# EAGLE design HallShield (EAGLE 6.2)

## Sheet 1 of 2
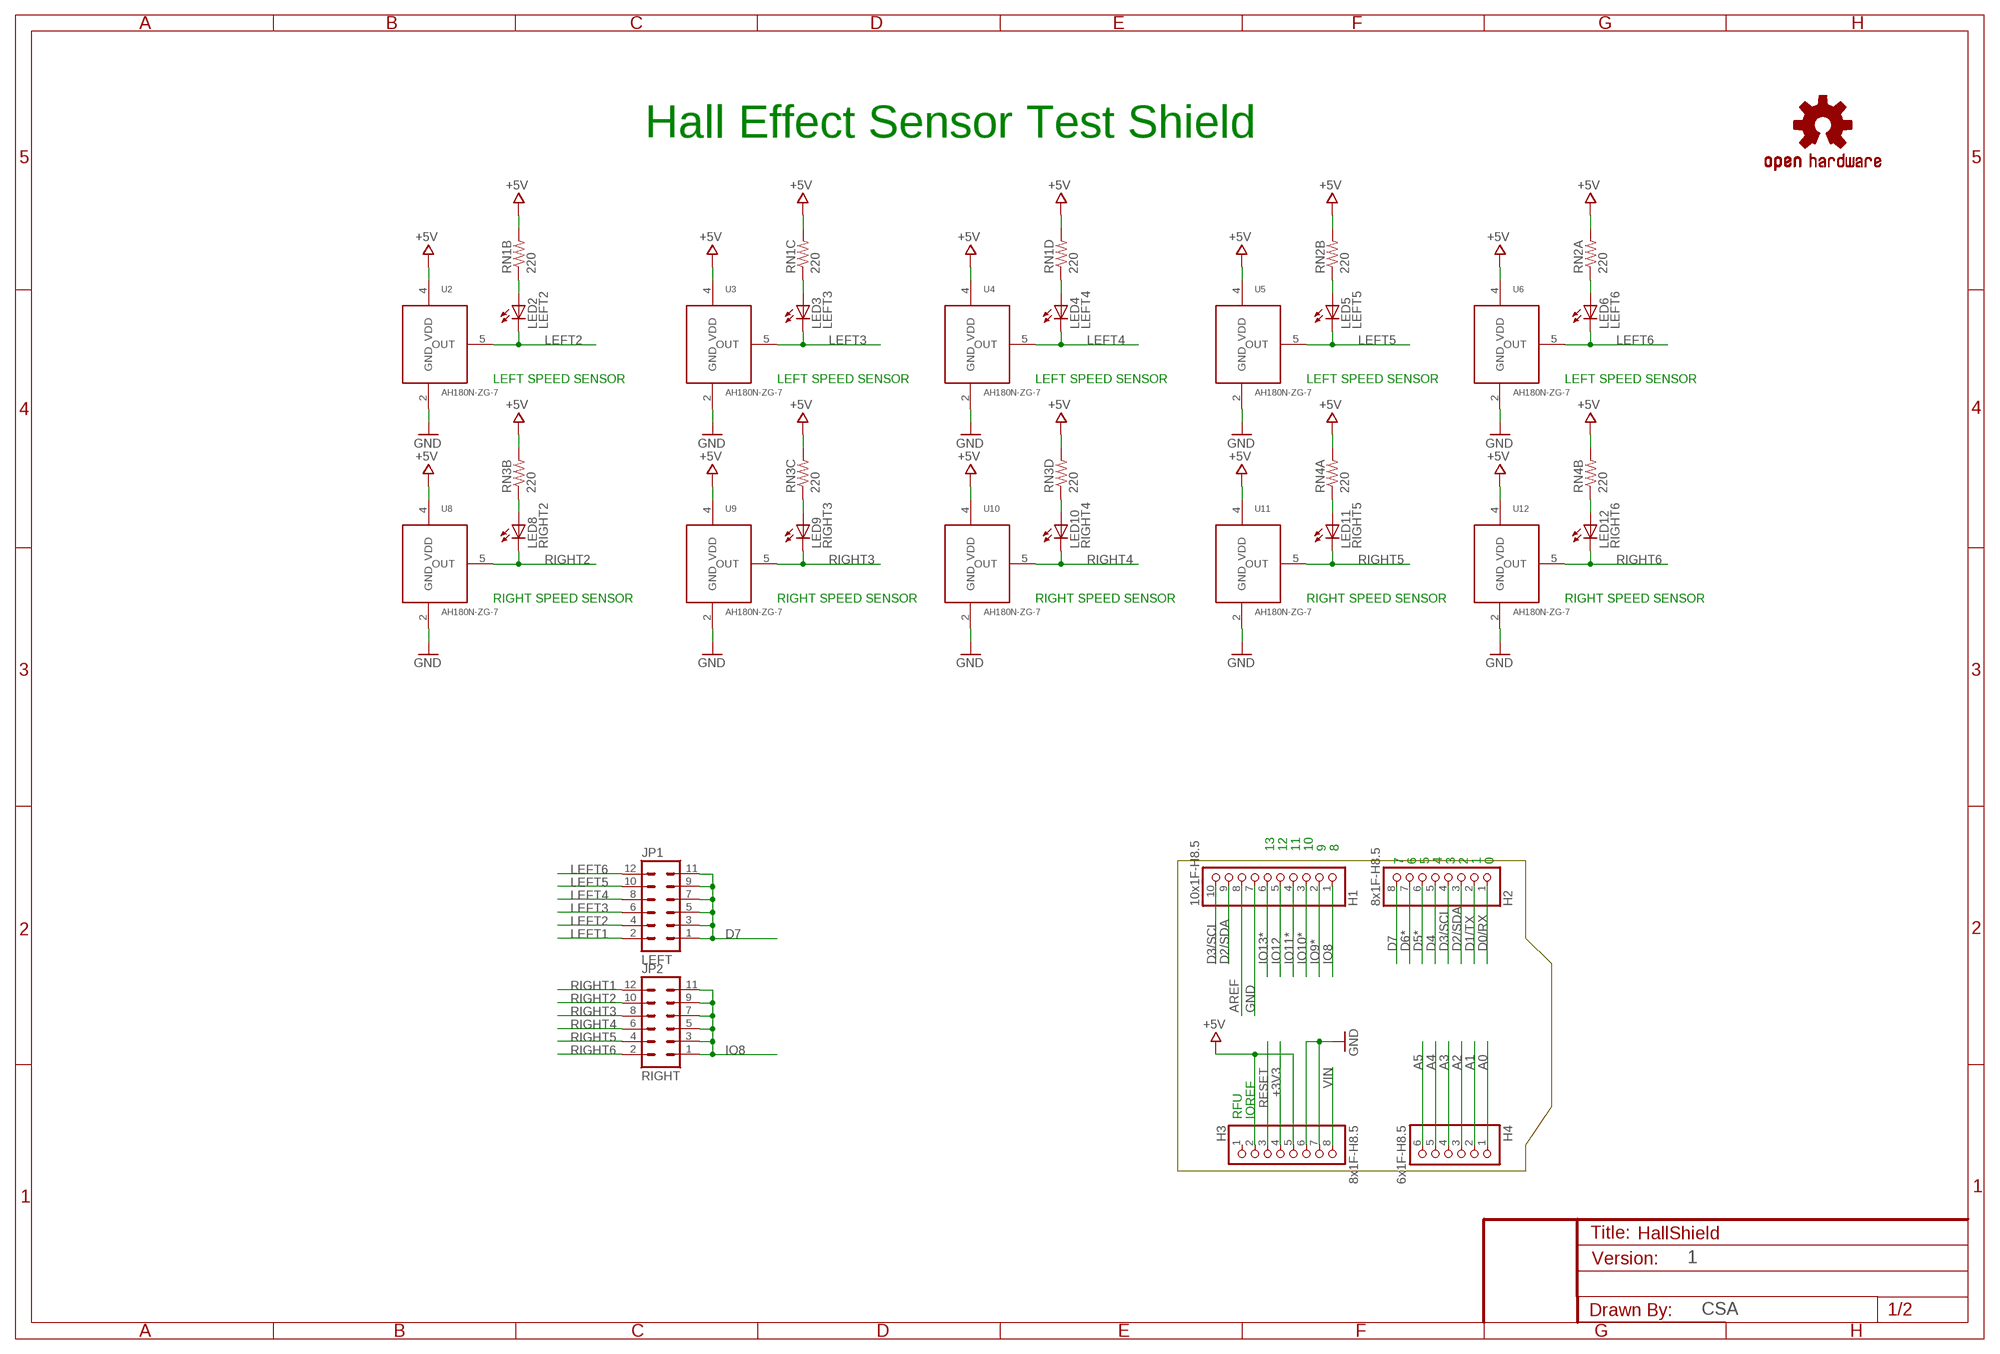
[diagram p0: schematic, sheet 1]

### Parts
H1  10x1F-H8.5  PINHD-1X10  [1X10]
H2  8x1F-H8.5  PINHD-1X8  [1X08]
H3  8x1F-H8.5  PINHD-1X8  [1X08]
H4  6x1F-H8.5  PINHD-1X6  [1X06]
JP1  LEFT  MA06-2  [MA06-2]
JP2  RIGHT  MA06-2  [MA06-2]
LED2  LEFT2  LED0805  [LED0805]
LED3  LEFT3  LED0805  [LED0805]
LED4  LEFT4  LED0805  [LED0805]
LED5  LEFT5  LED0805  [LED0805]
LED6  LEFT6  LED0805  [LED0805]
LED8  RIGHT2  LED0805  [LED0805]
LED9  RIGHT3  LED0805  [LED0805]
LED10  RIGHT4  LED0805  [LED0805]
LED11  RIGHT5  LED0805  [LED0805]
LED12  RIGHT6  LED0805  [LED0805]
RN1  220  RESISTOR-ARRAYCRA06S  [CRA06S]
RN2  220  RESISTOR-ARRAYCRA06S  [CRA06S]
RN3  220  RESISTOR-ARRAYCRA06S  [CRA06S]
RN4  220  RESISTOR-ARRAYCRA06S  [CRA06S]
U2  AH180N-ZG-7  [SOT553]
U3  AH180N-ZG-7  [SOT553]
U4  AH180N-ZG-7  [SOT553]
U5  AH180N-ZG-7  [SOT553]
U6  AH180N-ZG-7  [SOT553]
U8  AH180N-ZG-7  [SOT553]
U9  AH180N-ZG-7  [SOT553]
U10  AH180N-ZG-7  [SOT553]
U11  AH180N-ZG-7  [SOT553]
U12  AH180N-ZG-7  [SOT553]
U$5  OSHW-LOGOL  [OSHW-LOGO-L]

### Nets
+3V3: H3.4
+5V [power]: H3.2 H3.5 RN1.5 RN1.6 RN1.7 RN2.7 RN2.8 RN3.5 RN3.6 RN3.7 RN4.7 RN4.8 U2.4(VDD) U3.4(VDD) U4.4(VDD) U5.4(VDD) U6.4(VDD) U8.4(VDD) U9.4(VDD) U10.4(VDD) U11.4(VDD) U12.4(VDD) ; also sheet 2
A0: H4.1
A1: H4.2
A2: H4.3
A3: H4.4
A4: H4.5
A5: H4.6
AREF [aref]: H1.8
D0/RX: H2.1
D1/TX: H2.2
D2/SDA: H1.9 H2.3
D3/SCL: H1.10 H2.4
D4: H2.5
D5*: H2.6
D6*: H2.7
D7: H2.8 JP1.1 JP1.3 JP1.5 JP1.7 JP1.9 JP1.11
GND [gnd]: H1.7 H3.6 H3.7 U2.2(GND) U3.2(GND) U4.2(GND) U5.2(GND) U6.2(GND) U8.2(GND) U9.2(GND) U10.2(GND) U11.2(GND) U12.2(GND) ; also sheet 2
IO8: H1.1 JP2.1 JP2.3 JP2.5 JP2.7 JP2.9 JP2.11
IO9*: H1.2
IO10*: H1.3
IO11*: H1.4
IO12: H1.5
IO13*: H1.6
LEFT1: JP1.2 ; also sheet 2
LEFT2: JP1.4 LED2.C U2.5(OUT)
LEFT3: JP1.6 LED3.C U3.5(OUT)
LEFT4: JP1.8 LED4.C U4.5(OUT)
LEFT5: JP1.10 LED5.C U5.5(OUT)
LEFT6: JP1.12 LED6.C U6.5(OUT)
N$3: LED2.A RN1.2
N$4: LED3.A RN1.3
N$5: LED4.A RN1.4
N$6: LED5.A RN2.2
N$7: LED6.A RN2.1
N$8: LED8.A RN3.2
N$9: LED9.A RN3.3
N$10: LED10.A RN3.4
N$11: LED11.A RN4.1
N$12: LED12.A RN4.2
RESET: H3.3
RIGHT1: JP2.12 ; also sheet 2
RIGHT2: JP2.10 LED8.C U8.5(OUT)
RIGHT3: JP2.8 LED9.C U9.5(OUT)
RIGHT4: JP2.6 LED10.C U10.5(OUT)
RIGHT5: JP2.4 LED11.C U11.5(OUT)
RIGHT6: JP2.2 LED12.C U12.5(OUT)
VIN [power]: H3.8
Unconnected: H3.1 RN2.3 RN2.4 RN2.5 RN2.6 RN4.3 RN4.4 RN4.5 RN4.6

### Notes on the sheet
- Hall Effect Sensor Test Shield
- LEFT SPEED SENSOR | LEFT SPEED SENSOR | LEFT SPEED SENSOR | LEFT SPEED SENSOR | LEFT SPEED SENSOR
- RIGHT SPEED SENSOR | RIGHT SPEED SENSOR | RIGHT SPEED SENSOR | RIGHT SPEED SENSOR | RIGHT SPEED SENSOR
- 13 | 12 | 11 | 10 | 9 | 8
- 7 | 6 | 5 | 4 | 3 | 2 | 1 | 0
- RFU | IOREF
- 1
- CSA

## Sheet 2 of 2
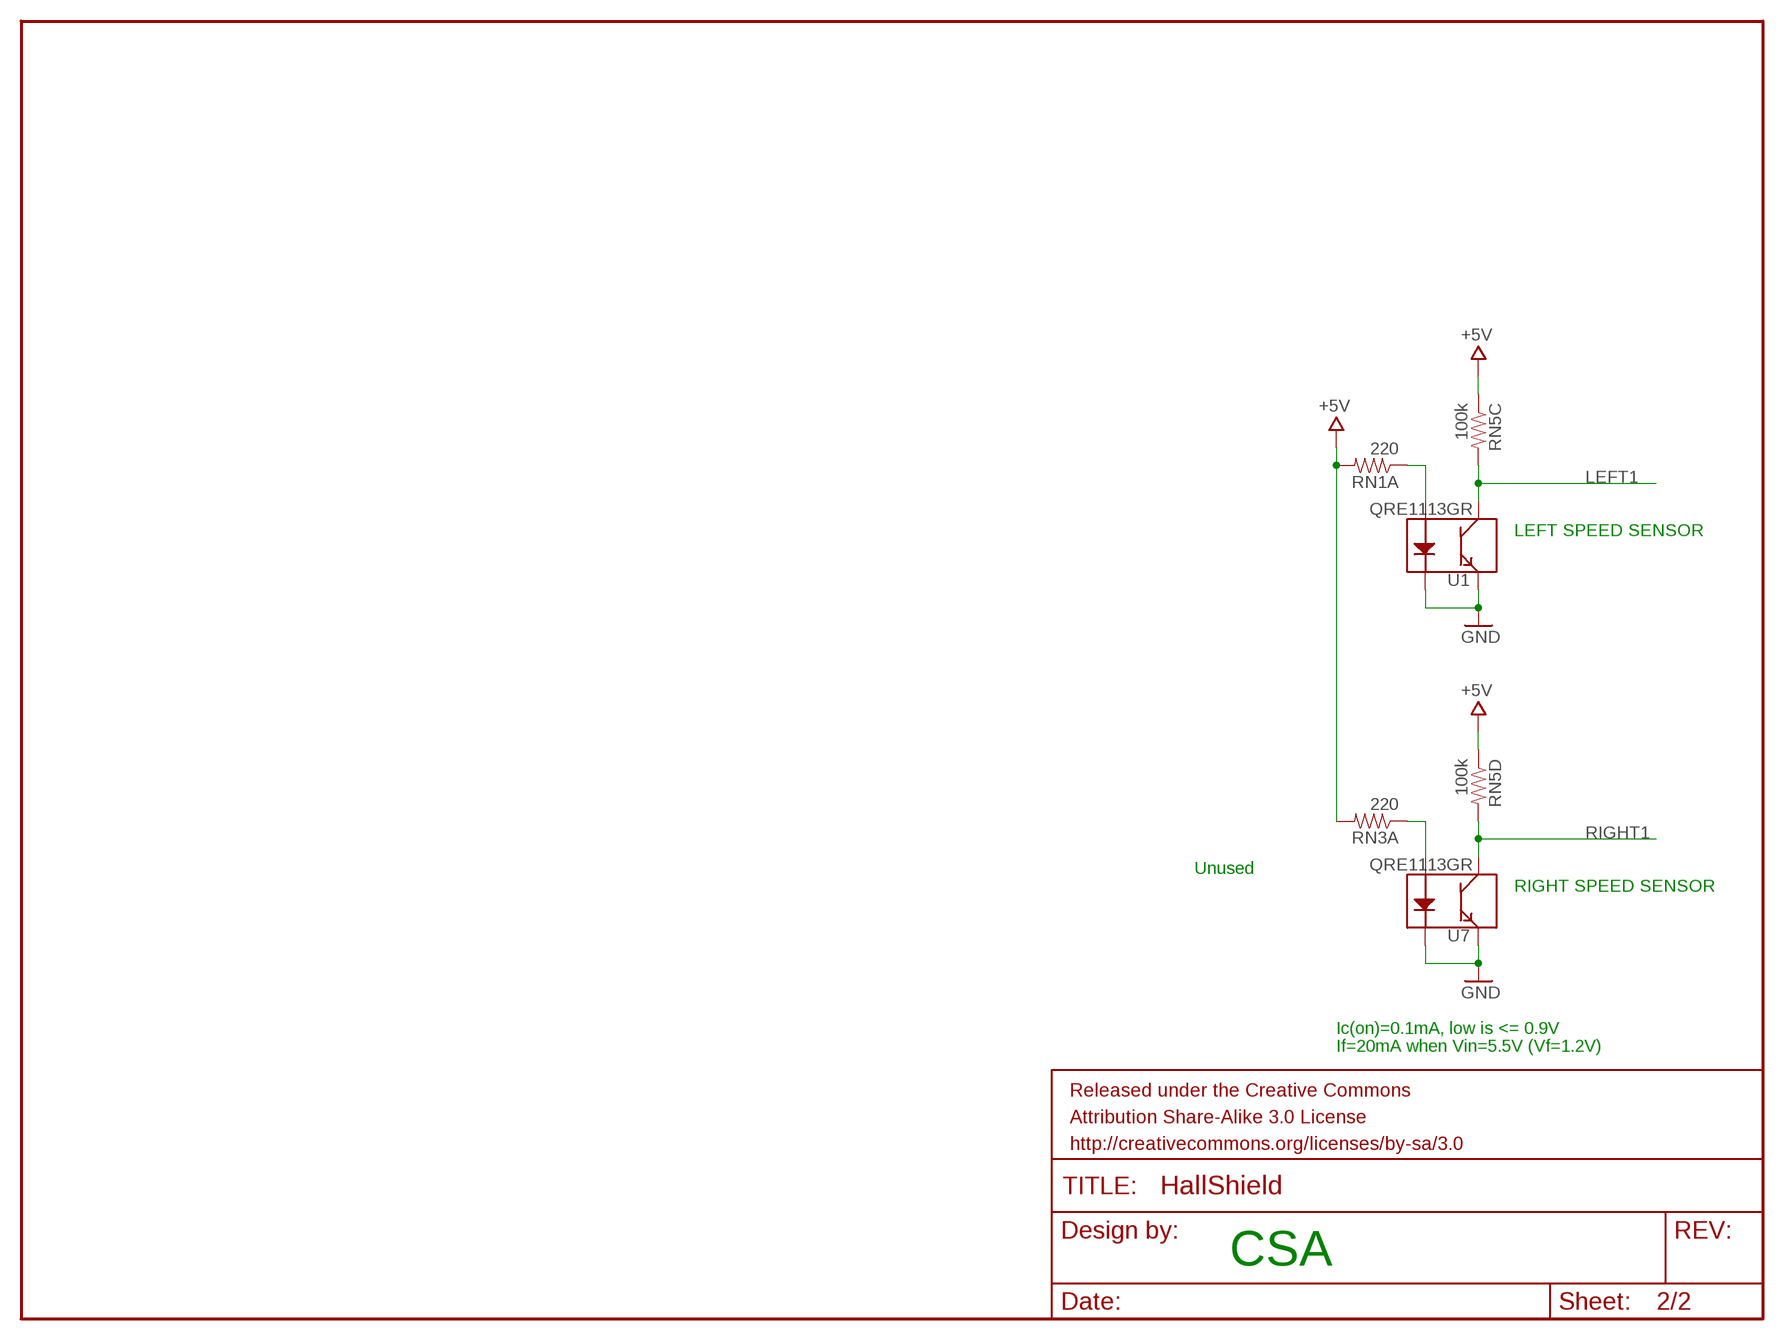
[diagram p1: schematic, sheet 2]

### Parts
RN5  100k  RESISTOR-ARRAYCRA06S  [CRA06S]
U1  QRE1113GR  [QRE1113GR]
U7  QRE1113GR  [QRE1113GR]

### Nets
+5V [power]: RN1.8 RN3.8 RN5.3 RN5.4 ; also sheet 1
GND [gnd]: U1.2(K) U1.4(E) U7.2(K) U7.4(E) ; also sheet 1
LEFT1: RN5.6 U1.3(C) ; also sheet 1
RIGHT1: RN5.5 U7.3(C) ; also sheet 1
U5_ANODE: RN1.1 U1.1(A)
U6_ANODE: RN3.1 U7.1(A)
Unconnected: RN5.1 RN5.2 RN5.7 RN5.8

### Notes on the sheet
- LEFT SPEED SENSOR
- Unused
- RIGHT SPEED SENSOR
- Ic(on)=0.1mA, low is <= 0.9V
- If=20mA when Vin=5.5V (Vf=1.2V)
- CSA

## Library data of the parts
H1 = SmartPrj:PINHD-1X10: PIN HEADER
H2 H3 = SmartPrj:PINHD-1X8: PIN HEADER
H4 = SmartPrj:PINHD-1X6: PIN HEADER
JP1 JP2 = con-lstb:MA06-2: PIN HEADER; OC_FARNELL: unknown; OC_NEWARK: unknown
LED2-LED6 LED8-LED12 = xorduino:LED
RN1-RN5 = xorduino:RESISTOR-ARRAY
U1 U7 = xorduino:QRE1113: Fairchild QRE1113 Miniature Reflective Object Sensor
U2-U6 U8-U12 = xorduino:AH180N
U$5 = SparkFun-Aesthetics:OSHW-LOGO: Open Source Hardware Logo This logo indicates the piece of hardware it is found on incorporates a OSHW license and/or adheres to the definition of open source hardware found here: http://freedomdefined.org/OSHW

## Net classes
0 default: width 0.203 mm, drill 0.406 mm, clearance 0.203 mm
1 power: width 0.203 mm, drill 0.406 mm, clearance 0.203 mm
2 gnd: width 0.203 mm, drill 0.406 mm, clearance 0.203 mm
3 usbvcc: width 0.203 mm, drill 0.406 mm, clearance 0.203 mm
4 aref: width 0.203 mm, drill 0.406 mm, clearance 0.203 mm

## Board
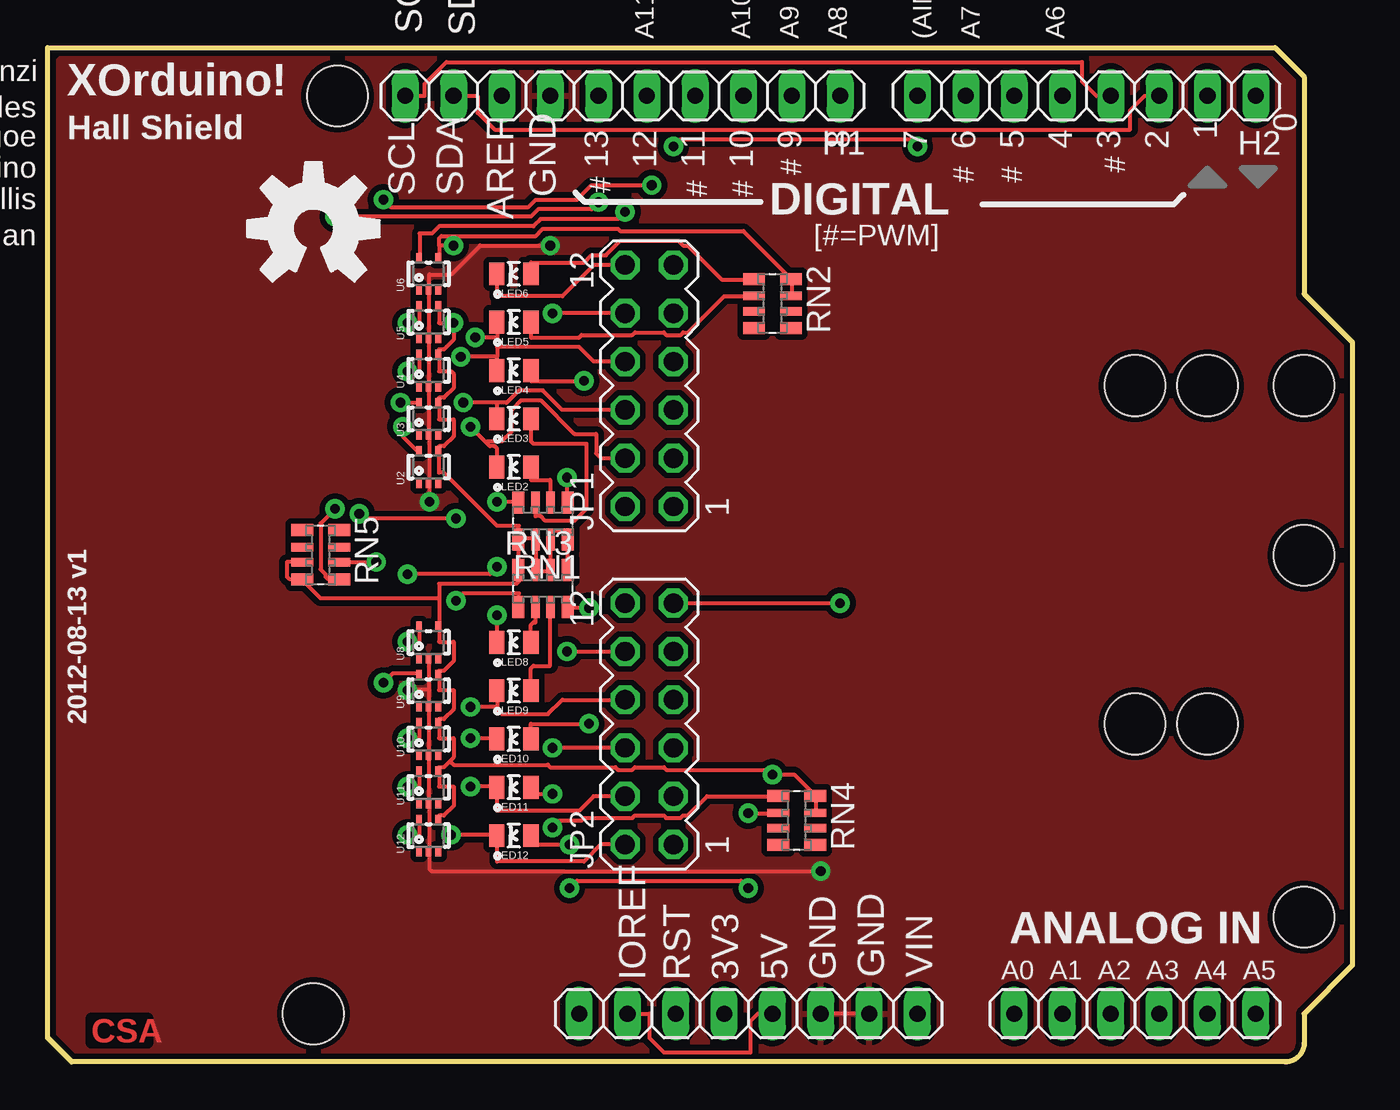
[diagram p2: board, top side]
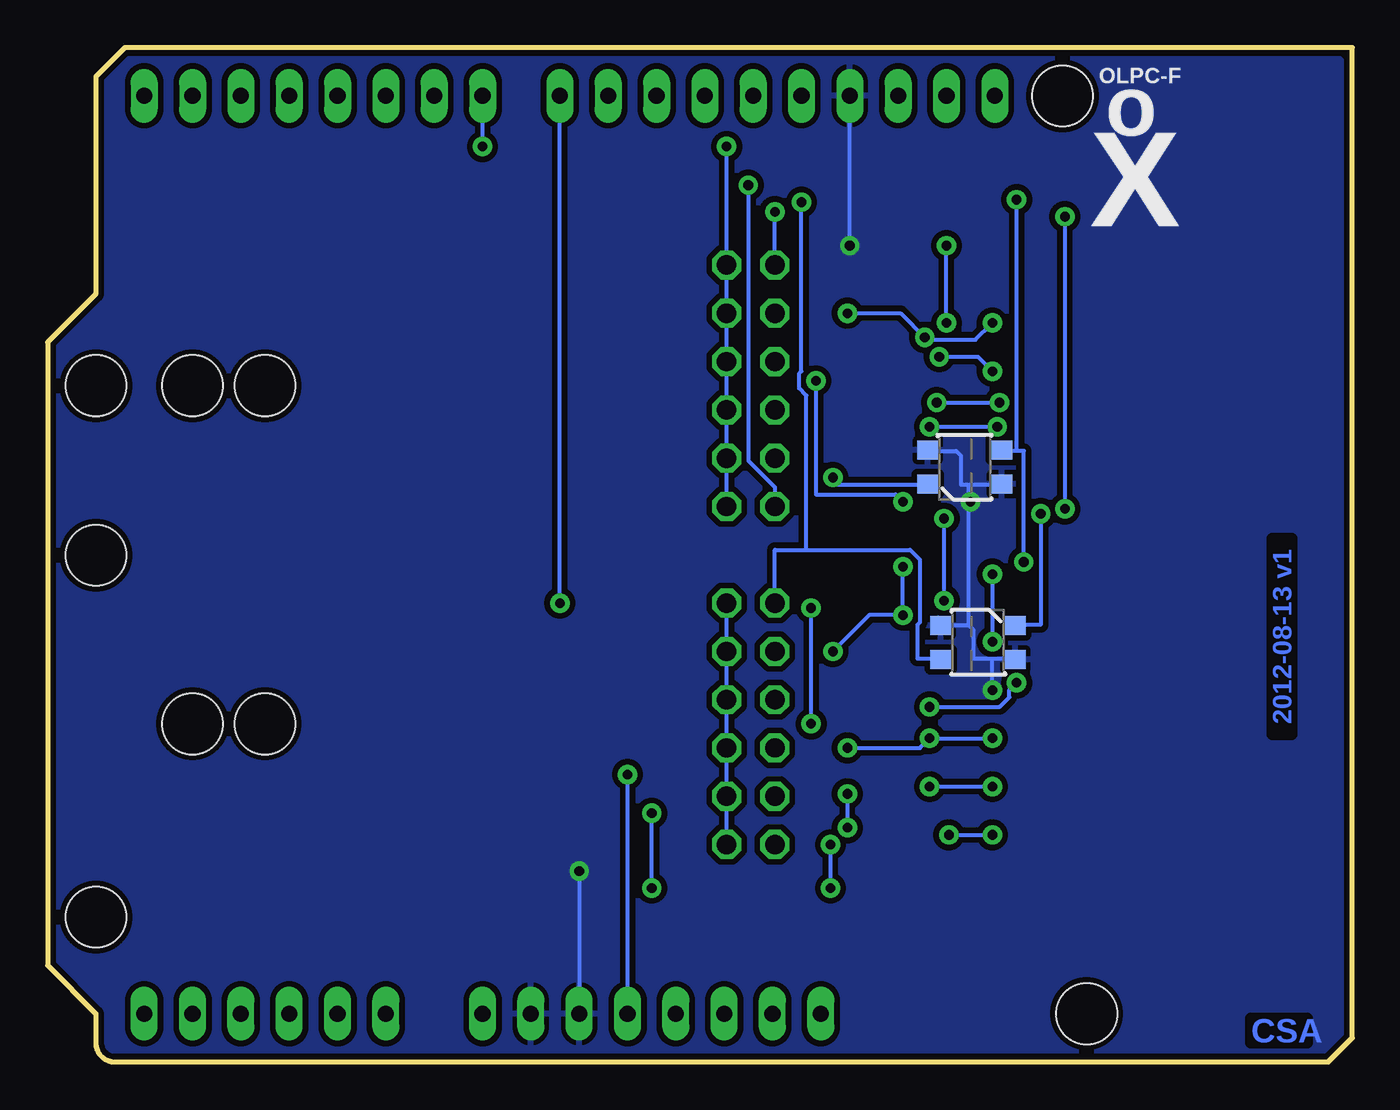
[diagram p3: board, bottom side, seen from below]

Size 68.58 x 53.34 mm. Coordinates in mm from the lower left corner, seen from the top.
Outline: 64.52,53.34 66.04,51.82 66.04,40.39 68.58,37.85 68.58,5.08 66.04,2.54 66.04,1 arc-90 65.04,0 1.27,0 0,1.27 0,53.34 64.52,53.34
Copper layers (1*2+15*16): Top 0.035mm / dielectric 0.2mm / Route2 0.035mm / dielectric 0.15mm / Route15 0.035mm / dielectric 0.2mm / Bottom 0.035mm
Design rules: minimum track width 8mil, minimum drill 20mil, track to track 8mil, track to pad 8mil, pad to pad 8mil, via to via 8mil, smd to smd 8mil, copper to edge 10mil, drill to drill 8mil, minimum pad ring 10mil, minimum via ring 10mil, stop-mask expansion 4mil, vias tented up to drill 25mil, thermal gap 10mil
Holes 3.2 mm at 66.04,35.56 66.04,7.62 15.24,50.8 13.97,2.54 66.04,26.65 57.15,35.56 60.96,35.56 60.96,17.78 57.15,17.78

### Footprints (pad centres in the part's own frame; a part is rotated, then mirrored left to right if it is on the bottom)
1X10 = drill 0.85 pad 1.422 long: 1 -11.43,0; 2 -8.89,0; 3 -6.35,0; 4 -3.81,0; 5 -1.27,0; 6 1.27,0; 7 3.81,0; 8 6.35,0; 9 8.89,0; 10 11.43,0
1X08 = drill 0.85 pad 1.422 long: 1 -8.89,0; 2 -6.35,0; 3 -3.81,0; 4 -1.27,0; 5 1.27,0; 6 3.81,0; 7 6.35,0; 8 8.89,0
1X06 = drill 0.85 pad 1.422 long: 1 -6.35,0; 2 -3.81,0; 3 -1.27,0; 4 1.27,0; 5 3.81,0; 6 6.35,0
MA06-2 = drill 1.016 octagon: 1 -6.35,-1.27; 2 -6.35,1.27; 3 -3.81,-1.27; 4 -3.81,1.27; 5 -1.27,-1.27; 6 -1.27,1.27; 7 1.27,-1.27; 8 1.27,1.27; 9 3.81,-1.27; 10 3.81,1.27; 11 6.35,-1.27; 12 6.35,1.27
LED0805 = smd 0.8 x 1.2: A -0.9,0; C 0.9,0
CRA06S = smd 0.63 x 1.15: 1 -1.295,-0.975; 4 1.295,-0.975; 5 1.295,0.975; 8 -1.295,0.975 | smd 0.44 x 1.15: 2 -0.4,-0.975; 3 0.4,-0.975; 6 0.4,0.975; 7 -0.4,0.975
QRE1113GR = smd 1.1 x 1: 1 -1.95,-0.9; 2 1.95,-0.9; 3 1.95,0.9; 4 -1.95,0.9
SOT553 = smd 0.3 x 0.5: 1 -0.5,-0.85; 2 0,-0.85; 3 0.5,-0.85; 4 0.5,0.85; 5 -0.5,0.85

### Placement (x,y rotation side)
H1  30.23,50.8 180 top
H2  54.61,50.8 180 top
H3  36.83,2.54 0 top
H4  57.15,2.54 0 top
JP1  31.62,35.56 90 top
JP2  31.62,17.78 90 top
LED2  24.51,31.28 180 top
LED3  24.51,33.82 180 top
LED4  24.51,36.36 180 top
LED5  24.51,38.9 180 top
LED6  24.51,41.44 180 top
LED8  24.51,22.06 180 top
LED9  24.51,19.52 180 top
LED10  24.51,16.98 180 top
LED11  24.51,14.44 180 top
LED12  24.51,11.9 180 top
RN1  26.04,28.45 180 top
RN2  38.1,39.88 270 top
RN3  26.04,24.89 0 top
RN4  39.37,12.7 270 top
RN5  14.35,26.67 270 top
U1  20.38,31.28 0 bottom
U2  20.03,31.28 0 top
U3  20.03,33.82 0 top
U4  20.03,36.36 0 top
U5  20.03,38.9 0 top
U6  20.03,41.44 0 top
U7  19.68,22.06 180 bottom
U8  20.03,22.06 0 top
U9  20.03,19.52 0 top
U10  20.03,16.98 0 top
U11  20.03,14.44 0 top
U12  20.03,11.9 0 top
U$5  13.97,43.81 0 top

### Tracks (layer width: path | path; a pad name or v marks a point on that pad's centre or on a via)
+5V  (via drill 0.51)
  Top 0.203: RN2.7 39.12,40.39 39.12,41.02 39.24,41.15 39.12,41.27 RN2.8 38.99,41.27 36.58,43.69 30.1,43.69 29.97,43.81 26.04,43.81 25.65,43.43 20.7,43.43 20.57,43.31 20.57,42.93 | U5.4 20.57,39.62 20.57,38.86 v21.34,38.86 21.34,37.97 20.83,37.47 20.57,37.47 20.57,37.21 U4.4 20.57,37.08 20.57,36.32 21.21,36.32 21.34,36.2 21.34,35.43 20.83,34.92 20.57,34.92 20.57,34.67 U3.4 20.57,34.54 20.57,33.78 21.34,33.78 21.34,32.89 20.83,32.38 20.57,32.38 20.57,32.13 U2.4 20.57,32 20.57,30.99 20.83,30.99 23.62,28.19 24.77,28.19 24.77,27.69 | 20.57,42.93 20.57,42.29 U6.4 | v21.34,42.93 20.57,42.93 | RN4.7 40.39,13.21 40.39,13.84 40.51,13.97 40.39,14.1 RN4.8 40.26,14.1 39.24,15.11 v38.1,15.11 37.85,15.37 32.51,15.37 32.38,15.49 30.86,15.49 30.73,15.37 29.97,15.37 29.84,15.49 26.42,15.49 26.29,15.62 21.34,15.62 21.21,15.75 21.14,15.81 | H3.5 37.34,2.54 36.96,2.16 36.96,0.51 32.38,0.51 31.62,1.27 31.62,2.54 H3.2 | U12.4 20.57,12.83 20.57,12.95 20.83,12.95 21.34,13.46 21.34,14.48 20.57,14.48 20.57,15.24 U11.4 20.57,15.37 20.57,15.49 20.83,15.49 21.14,15.81 | 21.14,15.81 21.34,16 21.34,17.02 20.57,17.02 20.57,17.78 U10.4 20.57,17.91 20.57,18.03 20.83,18.03 21.34,18.54 21.34,19.56 20.57,19.56 20.57,20.32 U9.4 20.57,20.45 20.57,20.57 20.83,20.57 21.34,21.08 21.34,22.1 20.57,22.1 20.57,22.86 U8.4 20.57,22.99 20.57,24.38 | RN3.5 27.3,25.91 27.3,27.43 RN1.8 27.3,27.56 27.3,27.94 26.42,27.94 26.42,27.56 RN1.7 26.42,27.43 26.42,25.91 RN3.6 26.54,25.78 26.42,25.65 26.29,25.78 25.65,25.78 RN3.7 25.65,25.91 25.65,27.43 RN1.6 25.53,27.56 24.89,27.56 24.77,27.69
  Top 0.203: RN5.3 13.34,26.29 12.57,26.29 12.57,25.53 12.7,25.4 13.34,25.4 RN5.4 13.46,25.27 14.35,24.38 20.57,24.38 | 20.57,24.38 20.57,25.15 24.64,25.15 24.77,25.27 24.77,25.78 RN3.8 24.77,25.91 24.77,27.43 RN1.5 | 24.77,27.69 24.64,27.56 RN1.5 | 24.77,27.69 RN1.5
  Bottom 0.203: v21.34,38.86 v21.34,42.93 | H3.5 v38.1,15.11
D2/SDA
  Top 0.203: H2.3 57.66,50.8 56.9,50.04 56.9,49.02 23.5,49.02 22.61,49.91 22.61,50.8 H1.9
D3/SCL
  Top 0.203: H2.4 55.12,50.8 54.36,51.56 54.36,52.58 20.95,52.58 19.81,51.44 19.81,50.8 H1.10
D7  (via drill 0.51)
  Top 0.203: v45.72,48.13 45.34,48.51 33.27,48.51 v32.89,48.13
  Bottom 0.203: JP1.1 JP1.3 JP1.5 JP1.7 JP1.9 JP1.11 v32.89,48.13 | v45.72,48.13 H2.8
GND  (via drill 0.51)
  Top 0.203: v26.42,42.93 22.73,42.93 21.21,41.4 20.07,41.4 20.07,40.64 U6.2 20.07,40.51 20.07,38.1 U5.2 20.07,37.97 20.07,35.56 U4.2 20.07,35.43 20.07,33.02 U3.2 20.07,32.89 20.07,30.48 U2.2 20.07,30.35 v20.07,29.46 | H3.7 H3.6 | 20.07,19.56 20.07,18.8 U9.2 20.07,18.67 20.07,16.26 U10.2 20.07,16.13 20.07,13.72 U11.2 20.07,13.59 20.07,11.18 U12.2 20.07,11.05 20.07,10.16 20.19,10.03 v40.64,10.03 | 20.07,19.56 20.07,21.21 U8.2 | 20.07,19.56 v18.92,19.56
  Bottom 0.203: 18.92,21.21 19.94,21.21 19.94,22.73 20.19,22.99 | 18.92,21.21 17.78,21.21 U7.4 | 20.19,22.99 21.59,22.99 U7.2 | 20.19,30.35 20.57,30.35 20.57,31.88 20.83,32.13 22.23,32.13 U1.4 | 20.19,30.35 18.54,30.35 U1.2 | 20.19,30.35 20.19,29.46 | 20.19,29.46 20.19,22.99 | v26.42,42.93 H1.7 | v20.07,29.46 20.19,29.46 | v40.64,10.03 H3.6 | v18.92,19.56 18.92,21.21
  pour Bottom (isolate 0.305): 0,1.27 0,52.07 1.27,53.34 64.77,53.34 66.04,52.07 66.04,40.64 68.58,38.1 68.58,5.08 66.04,2.54 66.04,1.27 64.77,0 2.54,0
  pour Top (isolate 0.305): 0,1.27 0,52.07 1.27,53.34 64.77,53.34 66.04,52.07 66.04,40.64 68.58,38.1 68.58,5.08 66.04,2.54 66.04,1.27 64.77,0 2.54,0
IO8  (via drill 0.51)
  Top 0.203: JP2.11 v41.66,24.13
  Bottom 0.203: JP2.1 JP2.3 JP2.5 JP2.7 JP2.9 JP2.11 | v41.66,24.13 H1.1
LEFT1  (via drill 0.51)
  Top 0.203: v17.27,26.29 15.37,26.29 RN5.6 | v31.75,46.1 28.57,46.1 27.81,45.34 25.65,45.34 25.27,44.96 18.03,44.96 v17.65,45.34
  Bottom 0.203: 17.65,32.13 17.27,32.13 v17.27,26.29 | 17.65,32.13 18.41,32.13 U1.3 | JP1.2 30.35,30.23 31.75,31.62 v31.75,46.1 | 17.65,32.13 v17.65,45.34
LEFT2  (via drill 0.51)
  Top 0.203: v18.67,33.4 18.67,32.89 19.43,32.13 U2.5 | 23.05,32.58 23.24,32.38 23.5,32.38 23.62,32.26 23.62,31.37 LED2.C | 23.05,32.58 v22.23,33.4 | JP1.4 29.08,31.75 28.83,32 28.83,33.02 27.69,33.02 25.91,34.8 24.89,34.8 24.38,34.29 24.38,33.15 23.88,32.64 23.11,32.64 23.05,32.58
  Bottom 0.203: v22.23,33.4 v18.67,33.4
LEFT3  (via drill 0.51)
  Top 0.203: v18.54,34.67 19.43,34.67 U3.5 | 23.62,34.67 v21.84,34.67 | 23.62,34.67 23.62,33.91 LED3.C | 23.62,34.67 24.13,34.67 24.77,35.31 26.04,35.31 27.05,34.29 JP1.6
  Bottom 0.203: v21.84,34.67 v18.54,34.67
LEFT4  (via drill 0.51)
  Top 0.203: v18.92,36.32 19.56,36.32 19.56,37.08 U4.5 | 23.62,37.08 v21.72,37.08 | 23.62,37.08 23.62,36.45 LED4.C | 23.62,37.08 23.62,37.59 27.94,37.59 28.7,36.83 JP1.8
  Bottom 0.203: v18.92,36.32 19.68,37.08 v21.72,37.08
LEFT5  (via drill 0.51)
  Top 0.203: v18.92,38.86 19.56,38.86 19.56,39.62 U5.5 | v22.48,38.1 23.62,38.1 23.62,38.86 LED5.C | JP1.10 v26.54,39.37
  Bottom 0.203: v18.92,38.86 19.81,37.97 22.48,37.97 v22.48,38.1 23.75,39.37 v26.54,39.37
LEFT6  (via drill 0.51)
  Top 0.203: v30.35,44.7 29.97,44.32 25.91,44.32 25.53,43.94 20.57,43.94 20.19,43.56 19.56,43.56 19.56,42.29 U6.5 | JP1.12 28.7,41.91 27.05,40.26 23.62,40.26 23.62,41.4 LED6.C
  Bottom 0.203: JP1.12 v30.35,44.7
N$3
  Top 0.203: RN1.2 26.42,29.46 26.42,30.61 25.4,30.61 25.4,31.24 LED2.A
N$4
  Top 0.203: RN1.3 25.65,29.34 25.65,28.7 25.91,28.7 26.16,28.45 27.69,28.45 28.32,29.08 28.32,32.51 25.53,32.51 25.4,32.64 25.4,33.78 LED3.A
N$5  (via drill 0.51)
  Top 0.203: v23.62,29.46 24.64,29.46 RN1.4 | v28.19,35.81 25.4,35.81 25.4,36.32 LED4.A
  Bottom 0.203: v23.62,29.46 24,29.84 28.19,29.84 v28.19,35.81
N$6
  Top 0.203: RN2.2 37.08,40.26 35.56,40.26 33.66,38.35 33.4,38.35 33.27,38.23 32.51,38.23 32.38,38.35 30.86,38.35 30.73,38.23 28.07,38.23 27.94,38.1 25.4,38.1 25.4,38.86 LED5.A
N$7
  Top 0.203: RN2.1 37.08,41.15 35.43,41.15 33.66,42.93 33.4,42.93 33.15,43.18 30.1,43.18 29.34,42.42 28.57,42.42 28.19,42.04 25.4,42.04 25.4,41.53 LED6.A
N$8
  Top 0.203: RN3.2 25.65,23.88 25.65,23.11 25.53,23.11 25.4,22.99 25.4,22.1 LED8.A
N$9
  Top 0.203: RN3.3 26.42,23.88 26.42,20.83 25.53,20.83 25.4,20.7 25.4,19.56 LED9.A
N$10  (via drill 0.51)
  Top 0.203: v28.45,23.88 27.43,23.88 RN3.4 | v28.45,17.78 25.4,17.78 25.4,17.02 LED10.A
  Bottom 0.203: v28.45,17.78 v28.45,23.88
N$11  (via drill 0.51)
  Top 0.203: v26.54,12.32 26.92,12.7 28.07,12.7 28.19,12.83 30.73,12.83 30.86,12.95 32.38,12.95 32.51,12.83 33.27,12.83 33.4,12.95 33.66,12.95 34.67,13.97 38.35,13.97 RN4.1 | v26.54,14.1 25.4,14.1 25.4,14.35 LED11.A
  Bottom 0.203: v26.54,14.1 v26.54,12.32
N$12  (via drill 0.51)
  Top 0.203: v36.83,13.08 38.35,13.08 RN4.2 | v36.83,9.14 36.45,9.53 27.81,9.53 v27.43,9.14 | v27.43,11.43 25.4,11.43 25.4,11.81 LED12.A
  Bottom 0.203: v36.83,9.14 v36.83,13.08 | v27.43,11.43 v27.43,9.14
RIGHT1  (via drill 0.51)
  Top 0.203: v15.11,29.08 14.35,28.32 14.35,25.91 14.61,25.65 14.61,25.53 14.73,25.4 15.24,25.4 RN5.5 | v15.11,44.45 25.4,44.45 25.78,44.83 28.57,44.83 v28.96,45.21
  Bottom 0.203: 28.7,26.92 30.35,26.92 JP2.12 | 28.7,26.92 23.24,26.92 22.73,26.42 22.73,23.11 22.86,22.99 22.86,21.21 21.72,21.21 U7.3 | v15.11,44.45 v15.11,29.08 | v28.96,45.21 28.96,36.32 29.08,36.2 29.08,35.43 28.7,35.05 28.7,26.92
RIGHT2  (via drill 0.51)
  Top 0.203: v18.92,22.1 19.56,22.1 19.56,22.86 U8.5 | v18.92,25.65 23.24,25.65 v23.62,26.04 | v23.62,23.5 23.62,22.1 LED8.C | v27.3,21.59 JP2.10
  Bottom 0.203: v18.92,25.65 v18.92,22.1 | v23.62,26.04 v23.62,23.5 25.4,23.5 v27.3,21.59
RIGHT3  (via drill 0.51)
  Top 0.203: v17.65,19.94 18.16,20.45 19.43,20.45 U9.5 | 23.5,18.67 23.62,18.67 23.62,19.43 LED9.C | 23.5,18.67 v22.23,18.67 | JP2.8 27.05,19.05 26.29,18.29 23.88,18.29 23.5,18.67
  Bottom 0.203: v17.65,19.94 18.03,19.56 18.03,19.18 18.54,18.67 v22.23,18.67
RIGHT4  (via drill 0.51)
  Top 0.203: v18.92,17.02 19.56,17.02 19.56,17.78 U10.5 | v22.23,17.02 23.5,17.02 LED10.C | JP2.6 v26.54,16.51
  Bottom 0.203: v18.92,17.02 v22.23,17.02 22.73,16.51 v26.54,16.51
RIGHT5  (via drill 0.51)
  Top 0.203: v18.92,14.48 19.56,14.48 19.56,15.24 U11.5 | v22.23,14.48 23.5,14.48 LED11.C 23.62,14.35 23.62,13.21 27.94,13.21 28.7,13.97 JP2.4
  Bottom 0.203: v22.23,14.48 v18.92,14.48
RIGHT6  (via drill 0.51)
  Top 0.203: v18.92,11.94 19.56,11.94 19.56,12.7 U12.5 | v21.21,11.94 23.5,11.94 LED12.C 23.62,11.81 23.62,10.54 28.19,10.54 29.08,11.43 JP2.2
  Bottom 0.203: v21.21,11.94 v18.92,11.94
U5_ANODE  (via drill 0.51)
  Top 0.203: v27.3,30.73 27.3,29.46 RN1.1
  Bottom 0.203: v27.3,30.73 27.3,30.35 22.35,30.35 U1.1
U6_ANODE  (via drill 0.51)
  Top 0.203: v16.38,28.83 16.64,28.57 v21.46,28.57 | v21.46,24.26 21.84,24.64 24.77,24.64 24.77,24 RN3.1
  Bottom 0.203: v16.38,28.83 16.38,22.99 17.65,22.99 U7.1 | v21.46,24.26 v21.46,28.57

### Text on the board
Top: CSA
Bottom: 2012-08-13 v1 | CSA
tPlace: XOrduino! | 1 | 0 | Hall Shield | 13 | 12 | 11 | 10 | 9 | 8 | 7 | 6 | 5 | 4 | 3 | 2 | # | # | SCL | SDA | # | # | # | GND | # | # | DIGITAL | AREF | [#=PWM] | 2012-08-13 v1 | ANALOG | IN | IOREF | RST | 3V3 | 5V | GND | GND | VIN | A0 | A1 | A2 | A3 | A4 | A5
bPlace: OLPC-F | o | X
tNames: PWM COMPL1 | PWM COMPL2 | SCL | SDA | A11 | A10 | A9 | A8 | (AIN0) | A7 | A6 | M.Banzi | D.Cuartielles | T.Igoe | G.Martino | D.Mellis | C. Scott Ananian
tDocu: XOrduino! | TX1 | RX1